# Altium schematic sheet Motor_Driver_THT.SchDoc
size A4
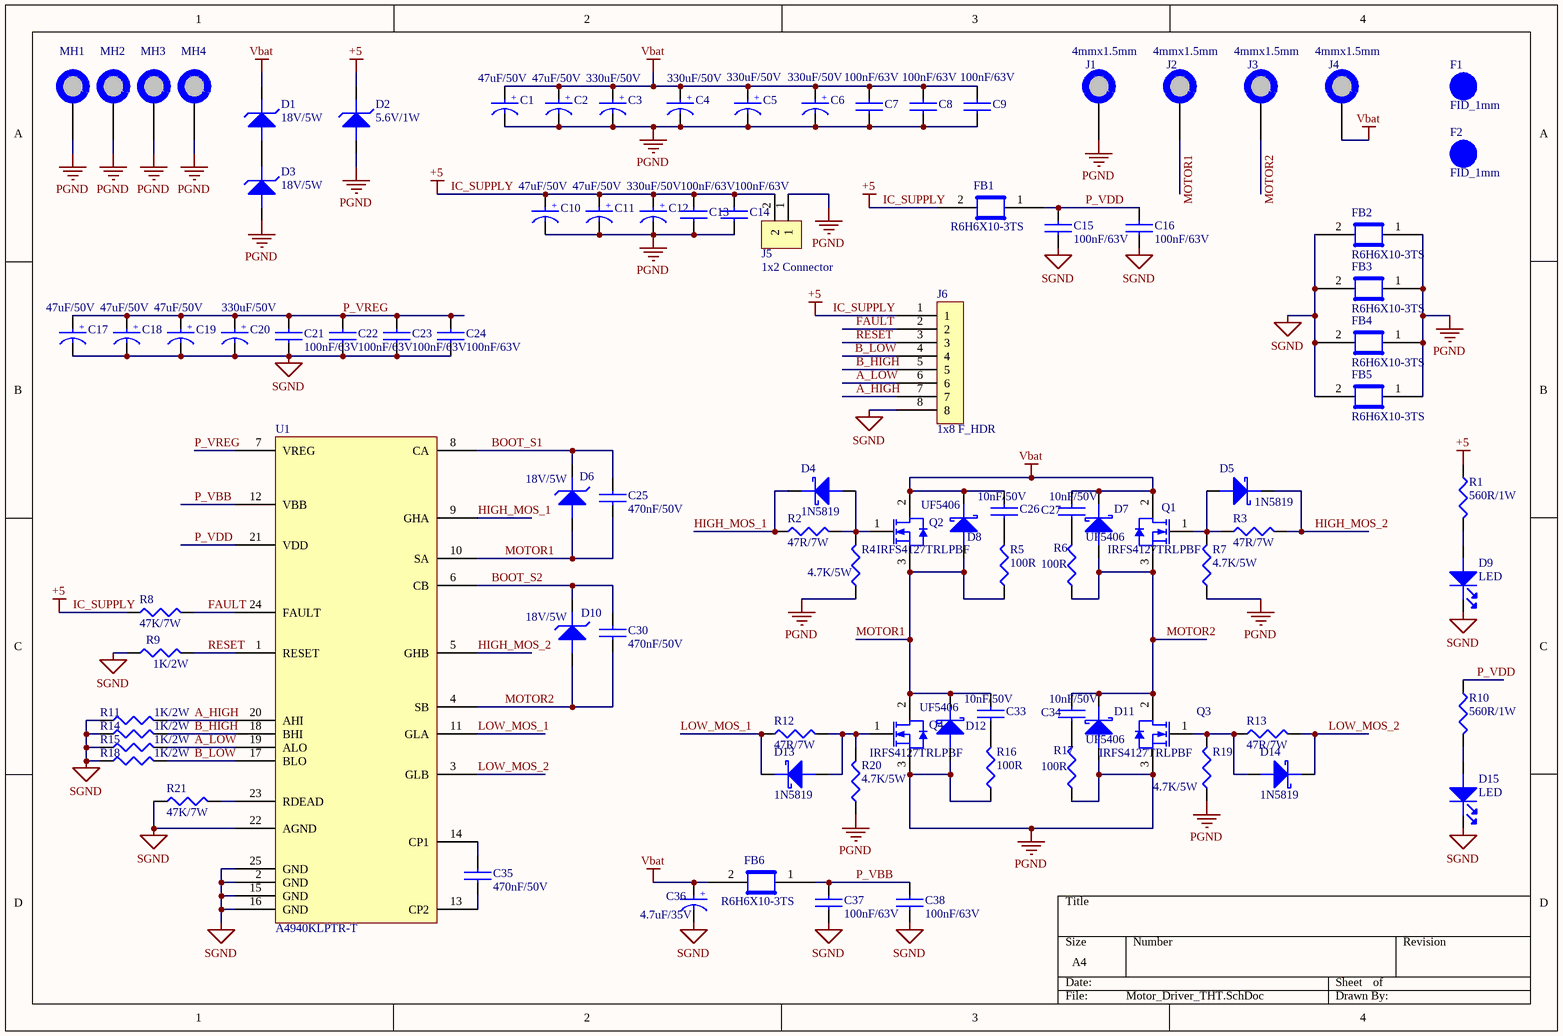
[diagram p0: Motor_Driver_THT.SchDoc]

## Parts
C1  47uF/50V  [6.3x11x2.5Capacitor]
C2  47uF/50V  [6.3x11x2.5Capacitor]
C3  330uF/50V  [THT-CAP/10x16]
C4  330uF/50V  [THT-CAP/10x16]
C5  330uF/50V  [THT-CAP/10x16]
C6  330uF/50V  [THT-CAP/10x16]
C7  100nF/63V  [Film Cap]
C8  100nF/63V  [Film Cap]
C9  100nF/63V  [Film Cap]
C10  47uF/50V  [6.3x11x2.5Capacitor]
C11  47uF/50V  [6.3x11x2.5Capacitor]
C12  330uF/50V  [THT-CAP/10x16]
C13  100nF/63V  [Film Cap]
C14  100nF/63V  [Film Cap]
C15  100nF/63V  [CERAMIC CAP]
C16  100nF/63V  [CERAMIC CAP]
C17  47uF/50V  [6.3x11x2.5Capacitor]
C18  47uF/50V  [6.3x11x2.5Capacitor]
C19  47uF/50V  [6.3x11x2.5Capacitor]
C20  330uF/50V  [THT-CAP/10x16]
C21  100nF/63V  [CERAMIC CAP]
C22  100nF/63V  [CERAMIC CAP]
C23  100nF/63V  [CERAMIC CAP]
C24  100nF/63V  [CERAMIC CAP]
C25  470nF/50V  [Film Cap]
C26  10nF/50V  [CERAMIC CAP]
C27  10nF/50V  [CERAMIC CAP]
C30  470nF/50V  [Film Cap]
C33  10nF/50V  [CERAMIC CAP]
C34  10nF/50V  [CERAMIC CAP]
C35  470nF/50V  [Film Cap]
C36  4.7uF/35V  [TANTALUM CAP THT 1]
C37  100nF/63V  [CERAMIC CAP]
C38  100nF/63V  [CERAMIC CAP]
D1  18V/5W  [1N4745]
D2  5.6V/1W  [1N4745]
D3  18V/5W  [1N4745]
D4  1N5819  [1N5819]
D5  1N5819  [1N5819]
D6  18V/5W  [1N4745]
D7  UF5406  [UF5406]
D8  UF5406  [UF5406]
D9  LED  [5mm LED]
D10  18V/5W  [1N4745]
D11  UF5406  [UF5406]
D12  UF5406  [UF5406]
D13  1N5819  [1N5819]
D14  1N5819  [1N5819]
D15  LED  [5mm LED]
F1  FID_1mm  [FID_40x120D]
F2  FID_1mm  [FID_40x120D]
FB1  R6H6X10-3TS  [1N4745]
FB2  R6H6X10-3TS  [1N4745]
FB3  R6H6X10-3TS  [1N4745]
FB4  R6H6X10-3TS  [1N4745]
FB5  R6H6X10-3TS  [1N4745]
FB6  R6H6X10-3TS  [1N4745]
J1  4mmx1.5mm  [PAD_WITH_HOLE_4mmx1.5mm]  (no BOM)
J2  4mmx1.5mm  [PAD_WITH_HOLE_4mmx1.5mm]  (no BOM)
J3  4mmx1.5mm  [PAD_WITH_HOLE_4mmx1.5mm]  (no BOM)
J4  4mmx1.5mm  [PAD_WITH_HOLE_4mmx1.5mm]  (no BOM)
J5  1x2 Connector  [Klemens 1x2]
J6  1x8 F_HDR  [1x8 2.54 mm F_HDR]
MH1  MOUNTING HOLE_7.4MMC_3.2MMD  [MH_7.2MMC_3.2MMD]  (value not drawn)
MH2  MOUNTING HOLE_7.4MMC_3.2MMD  [MH_7.2MMC_3.2MMD]  (value not drawn)
MH3  MOUNTING HOLE_7.4MMC_3.2MMD  [MH_7.2MMC_3.2MMD]  (value not drawn)
MH4  MOUNTING HOLE_7.4MMC_3.2MMD  [MH_7.2MMC_3.2MMD]  (value not drawn)
Q1  IRFS4127TRLPBF  [TO-220]
Q2  IRFS4127TRLPBF  [TO-220]
Q3  IRFS4127TRLPBF  [TO-220]
Q4  IRFS4127TRLPBF  [TO-220]
R1  560R/1W  [THT Resistor]
R2  47R/7W  [THT Resistor]
R3  47R/7W  [THT Resistor]
R4  4.7K/5W  [THT Resistor]
R5  100R  [THT Resistor]
R6  100R  [THT Resistor]
R7  4.7K/5W  [THT Resistor]
R8  47K/7W  [THT Resistor]
R9  1K/2W  [THT Resistor]
R10  560R/1W  [THT Resistor]
R11  1K/2W  [THT Resistor]
R12  47R/7W  [THT Resistor]
R13  47R/7W  [THT Resistor]
R14  1K/2W  [THT Resistor]
R15  1K/2W  [THT Resistor]
R16  100R  [THT Resistor]
R17  100R  [THT Resistor]
R18  1K/2W  [THT Resistor]
R19  4.7K/5W  [THT Resistor]
R20  4.7K/5W  [THT Resistor]
R21  47K/7W  [THT Resistor]
U1  A4940KLPTR-T  [A4940-TSOP65P640X120_HS-25N]

## Nets
IC_SUPPLY: C10.1 C11.1 C12.1 C13.2 C14.2 D2.1(Cathode) FB1.2 J5.2 J6.1 R1.1 R8.1  [also labelled +5]
PGND: C1.2 C2.2 C3.2 C4.2 C5.2 C6.2 C7.2 C8.2 C9.2 C10.2 C11.2 C12.2 C13.1 C14.1 D2.2(Anode) D3.2(Anode) D11.2(Anode) D12.2(Anode) FB2.1 FB3.1 FB4.1 FB5.1 J1.1 J5.1 MH1.1 MH2.1 MH3.1 MH4.1 Q3.3(SOURCE) Q4.3(SOURCE) R4.1 R7.1 R16.1 R17.1 R19.1 R20.1
SGND: C15.1 C16.1 C17.2 C18.2 C19.2 C20.2 C21.1 C22.1 C23.1 C24.1 C36.2 C37.1 C38.1 D9.1(Cathode) D15.1(Cathode) FB2.2 FB3.2 FB4.2 FB5.2 J6.8 R9.1 R11.1 R14.1 R15.1 R18.1 R21.1 U1.2(GND) U1.15(GND) U1.16(GND) U1.22(AGND) U1.25(GND)
Vbat: C1.1 C2.1 C3.1 C4.1 C5.1 C6.1 C7.1 C8.1 C9.1 C26.2 C27.2 C36.1 D1.1(Cathode) D7.1(Cathode) D8.1(Cathode) FB6.2 J4.1 Q1.2(DRAIN) Q2.2(DRAIN)
A_HIGH: J6.7 R11.2 U1.20(AHI)
A_LOW: J6.6 R15.2 U1.19(ALO)
B_HIGH: J6.5 R14.2 U1.18(BHI)
B_LOW: J6.4 R18.2 U1.17(BLO)
BOOT_S1: C25.2 D6.1(Cathode) U1.8(CA)
BOOT_S2: C30.2 D10.1(Cathode) U1.6(CB)
FAULT: J6.2 R8.2 U1.24(FAULT)
HIGH_MOS_1: D4.1(Cathode) R2.1 U1.9(GHA)
HIGH_MOS_2: D5.1(Cathode) R3.2 U1.5(GHB)
LOW_MOS_1: D13.1(Cathode) R12.1 U1.11(GLA)
LOW_MOS_2: D14.1(Cathode) R13.2 U1.3(GLB)
MOTOR1: C25.1 C33.2 D6.2(Anode) D8.2(Anode) D12.1(Cathode) J2.1 Q2.3(SOURCE) Q4.2(DRAIN) R5.1 U1.10(SA)
MOTOR2: C30.1 C34.2 D7.2(Anode) D10.2(Anode) D11.1(Cathode) J3.1 Q1.3(SOURCE) Q3.2(DRAIN) R6.1 U1.4(SB)
P_VBB: C37.2 C38.2 FB6.1 U1.12(VBB)
P_VDD: C15.2 C16.2 FB1.1 R10.1 U1.21(VDD)
P_VREG: C17.1 C18.1 C19.1 C20.1 C21.2 C22.2 C23.2 C24.2 U1.7(VREG)
RESET: J6.3 R9.2 U1.1(RESET)
NetC26_1: C26.1 R5.2
NetC27_1: C27.1 R6.2
NetC33_1: C33.1 R16.2
NetC34_1: C34.1 R17.2
NetC35_1: C35.1 U1.13(CP2)
NetC35_2: C35.2 U1.14(CP1)
NetD1_2: D1.2(Anode) D3.1(Cathode)
NetD4_2: D4.2(Anode) Q2.1(GATE) R2.2 R4.2
NetD5_2: D5.2(Anode) Q1.1(GATE) R3.1 R7.2
NetD9_2: D9.2(Anode) R1.2
NetD13_2: D13.2(Anode) Q4.1(GATE) R12.2 R20.2
NetD14_2: D14.2(Anode) Q3.1(GATE) R13.1 R19.2
NetD15_2: D15.2(Anode) R10.2
NetR21_2: R21.2 U1.23(RDEAD)

## Notes on the sheet
- (in symbol EXR470M50B) +
- (in symbol TKT4R7M3502BR) +
- (in symbol TZP331M1HG25R-330uF Aluminium) +

## Library data of the parts
C1 C2 C10 C11 C17-C19 = EXR470M50B: CAP.EL.47uF 50V 6x11 2.5mm
C3-C6 C12 C20 = TZP331M1HG25R-330uF Aluminium
C7-C9 C13 C14 = C241J104J20A201: Cap Film 0.1uF 63V PET 5% Stacked Radial 5mm 105°C Ammo Pack; Manufacturer: Surge Components; Capacitance: 100nF; Supplier 1: Avnet; Manufacturer Part Number: C241J104J20A201; RoHS: Yes; Category: Film Capacitors; Stock 1: 10000; Mount: Through Hole; Case/Package: Radial; Dielectric Material: PET; Min Operating Temperature: -55°C; Max Operating Temperature: 105°C; Termination: Radial; Voltage Rating: 63V; Tolerance: 5%; Lead Pitch: 5mm; Lead Free: Lead Free; ComponentLink1URL: https://datasheet.ciiva.com/17457/c241j104j20a201-17457906.pdf?src-supplier=Future+Electronics; ComponentLink1Description: https://datasheet.ciiva.com/17457/c241j104j20a201-17457906.pdf?src-supplier=Future+Electronics; Supplier Part Number 1: C241J104J20A201
C15 C16 C21-C24 C37 C38 = DSTK2614
C25 C30 C35 = DSTK2594
C26 C27 C33 C34 = SF1H103MB215Y
C36 = TKT4R7M3502BR
D1 D3 D6 D10 = 1N5355BRLG: ON SEMICONDUCTOR   1N5355BRLG   DIODE, ZENER, 18V, 5W, 017AA-2; Material: Plastic; Forward Voltage: 1.2V; Tolerance: 5%; Max Reverse Leakage Current: 500nA; Impedance: 2.5R; Zener Current: 264mA; Test Current: 65mA; Element Configuration: Single; ESD Protection: Yes; Supplier 1: RSComponents; Manufacturer: ON Semiconductor; Manufacturer Part Number: 1N5355BRLG; RoHS: Yes; Category: Zener Diodes; Stock 1: 34000; Pricing 1: 4000=0,17300, 8000=0,16100, 4000=1,32800, 8000=1,23900 (EUR); Case/Package: Axial; Number of Pins: 2; Weight: 0.01lb; Contact Plating: Tin,Matte; Min Operating Temperature: -65°C; Max Operating Temperature: 200°C; Package Quantity: 1; Max Power Dissipation: 5W; Packaging: Tape and Reel; Power Dissipation: 5W; Zener Voltage: 18V; Voltage Tolerance: 5%; Working Voltage: 18V; Max Reverse Current: 500nA; Voltage Rating (DC): 18V; Power Rating: 5W; Length: 8.89mm; Width: 3.68mm; Height: 3.68mm; Radiation Hardening: No; REACH SVHC: No SVHC; Lead Free: Lead Free; Halogen Free: Halogen Free; ComponentLink1URL: https://datasheet.ciiva.com/15142/getdatasheetpartid-53953-15142149.pdf?src-supplier=Verical; ComponentLink1Description: https://datasheet.ciiva.com/15142/getdatasheetpartid-53953-15142149.pdf?src-supplier=Verical; ComponentLink2URL: https://datasheet.ciiva.com/27051/1305181-27051928.pdf?src-supplier=Jameco; ComponentLink2Description: https://datasheet.ciiva.com/27051/1305181-27051928.pdf?src-supplier=Jameco; ComponentLink3URL: https://datasheet.ciiva.com/49028/70339225-49028950.pdf?src-supplier=Allied+Electronics; ComponentLink3Description: https://datasheet.ciiva.com/49028/70339225-49028950.pdf?src-supplier=Allied+Electronics; ComponentLink4URL: https://datasheet.ciiva.com/895/1n5333b-d-895371.pdf?src-supplier=Digi-Key; ComponentLink4Description: https://datasheet.ciiva.com/895/1n5333b-d-895371.pdf?src-supplier=Digi-Key; ComponentLink5URL: https://datasheet.ciiva.com/895/1n5333b-d-895372.pdf?src-supplier=Digi-Key; ComponentLink5Description: https://datasheet.ciiva.com/895/1n5333b-d-895372.pdf?src-supplier=Digi-Key; ComponentLink6URL: https://datasheet.ciiva.com/10639/1n5333b-d-10639005.pdf?src-supplier=Avnet; ComponentLink6Description: https://datasheet.ciiva.com/10639/1n5333b-d-10639005.pdf?src-supplier=Avnet; ComponentLink7URL: https://datasheet.ciiva.com/25927/1n5333b-d-25927373.pdf?src-supplier=Avnet+Europe; ComponentLink7Description: https://datasheet.ciiva.com/25927/1n5333b-d-25927373.pdf?src-supplier=Avnet+Europe; ComponentLink8URL: https://datasheet.ciiva.com/22626/1796584-22626831.pdf?src-supplier=Element14; ComponentLink8Description: https://datasheet.ciiva.com/22626/1796584-22626831.pdf?src-supplier=Element14; Supplier Part Number 1: 1868755
D2 = 1N4734A-HT
D4 D5 D13 D14 = 1N5819_AY_10001: Manufacturer: Pan Jit; Element Configuration: Single; Max Repetitive Reverse Voltage (Vrrm): 40V; Peak Non-Repetitive Surge Current: 25A; Forward Current: 1A; Max Reverse Current: 200uA; Supplier 1: Mouser; Manufacturer Part Number: 1N5819_AY_10001; RoHS: Yes; Category: Rectifier Diodes; Stock 1: 4975; Pricing 1: 1=0,41000, 10=0,22500, 100=0,10900, 500=0,08600, 1000=0,06000, 2500=0,05000 (USD); Mount: Through Hole; Number of Pins: 2; Min Operating Temperature: -55°C; Max Operating Temperature: 150°C; Radiation Hardening: No; ComponentLink1URL: https://datasheet.ciiva.com/8300/1n5817-series-8300210.pdf?src-supplier=Avnet; ComponentLink1Description: https://datasheet.ciiva.com/8300/1n5817-series-8300210.pdf?src-supplier=Avnet; Supplier Part Number 1: 241-1N5819_AY_10001
D9 D15 = LTL2R3SYK: LED AMBER CLEAR 5MM ROUND T/H; Manufacturer: Vishay Lite-On; Lens Color: Colorless; Color: Orange; Test Current: 20mA; Dominant Wavelength: 590nm; Lens Style: Dome; Luminous Intensity: 2800mcd; Viewing Angle: 30°; Wavelength: 594nm; Forward Voltage: 2.35V; Supplier 1: Mouser; Manufacturer Part Number: LTL2R3SYK; RoHS: Yes; Category: LEDs; Mount: Through Hole; Case/Package: Radial; Min Operating Temperature: -40°C; Max Operating Temperature: 80°C; Lens Transparency: Clear; Packaging: Bulk; Package Quantity: 1000; Illumination Color: Orange; Diameter: 5mm; Height: 8.7mm; ComponentLink1URL: http://www.mouser.com/ds/2/239/_100_LTL2P3SEK+SYK+2R3SEK+SYK-62951.pdf?src-supplier=Mouser; ComponentLink1Description: http://www.mouser.com/ds/2/239/_100_LTL2P3SEK+SYK+2R3SEK+SYK-62951.pdf?src-supplier=Mouser; ComponentLink2URL: https://media.digikey.com/pdf/Data%20Sheets/Lite-On%20PDFs/LTL2x3SEK,SYK.pdf?src-supplier=Digi-Key; ComponentLink2Description: https://media.digikey.com/pdf/Data%20Sheets/Lite-On%20PDFs/LTL2x3SEK,SYK.pdf?src-supplier=Digi-Key; Supplier Part Number 1: 859-LTL2R3SYK
F1 F2 = FID_1mm: Fiducial 40mil Diameter, 120mil mask
J1-J4 = PAD_WITH_HOLE_4mmx1.5mm
J5 = Klemens 2 Pin
J6 = 1X8 F_HDR 2.54mm
MH1-MH4 = MOUNTING HOLE_7.4MMC_3.2MMD: Mounting Hole  7.4mm, 3.2mm
Q1-Q4 = IRFS4127TRLPBF: MOSFET N-CH 200V 72A D2PAK; Manufacturer: International Rectifier; Rise Time: 18ns; Fall Time: 22ns; Turn-Off Delay Time: 56ns; Turn-On Delay Time: 17ns; Gate to Source Voltage (Vgs): 20V; Rds On Max: 22mR; Input Capacitance: 5.38nF; Max Power Dissipation: 375W; Element Configuration: Single; Supplier 1: Arrow; Manufacturer Part Number: IRFS4127TRLPBF; RoHS: Yes; Category: MOSFETs; Stock 1: 25; Pricing 1: 1=2,62080, 10=2,29670, 25=2,28010, 50=2,25740, 100=1,79330, 250=1,70640, 500=1,68930, 1000=1,44110, 3000=1,29240, 6000=1,28060, 15000=1,26780, 30000=1,25510, 75000=1,24260 (USD); Mount: Surface Mount; Case/Package: D2PAK; Number of Pins: 3; Min Operating Temperature: -55°C; Max Operating Temperature: 175°C; Continuous Drain Current (ID): 72A; Package Quantity: 1; Packaging: Tape and Reel; Drain to Source Voltage (Vdss): 200V; Drain to Source Breakdown Voltage: 200V; Drain to Source Resistance: 22mR; Power Dissipation: 375W; On-State Resistance: 22MR; ComponentLink1URL: https://datasheet.ciiva.com/939/irfs4127pbf-939456.pdf?src-supplier=Digi-Key; ComponentLink1Description: https://datasheet.ciiva.com/939/irfs4127pbf-939456.pdf?src-supplier=Digi-Key; ComponentLink2URL: https://datasheet.ciiva.com/939/irfs4127pbf-939457.pdf?src-supplier=Digi-Key; ComponentLink2Description: https://datasheet.ciiva.com/939/irfs4127pbf-939457.pdf?src-supplier=Digi-Key; ComponentLink3URL: https://datasheet.ciiva.com/939/irfs4127pbf-939458.pdf?src-supplier=Digi-Key; ComponentLink3Description: https://datasheet.ciiva.com/939/irfs4127pbf-939458.pdf?src-supplier=Digi-Key; ComponentLink4URL: https://datasheet.ciiva.com/16221/irfs4127pbf-16221031.pdf?src-supplier=Future+Electronics; ComponentLink4Description: https://datasheet.ciiva.com/16221/irfs4127pbf-16221031.pdf?src-supplier=Future+Electronics; Supplier Part Number 1: IRFS4127TRLPBF
R1 R10 = KNP01SJ0561A10
R2 R3 R12 R13 = RSS700470JB60
R4 R7 R19 R20 = MOR05UJ0472AA9
R5 R6 R16 R17 = KNP09SJ0101B00
R8 R21 = MOR07SJ0473B00: Manufacturer: Royal Ohm; Supplier 1: Avnet; Manufacturer Part Number: MOR07SJ0473B00; Supplier Part Number 1: YDL66R-24-61S46106
R9 R11 R14 R15 R18 = CFRF2SJ0102A19
U1 = A4940KLPTR-T: IC MOSF DVR FULL BRIDGE 24TSSOP; Manufacturer: Allegro MicroSystems; Number of Outputs: 4; Max Supply Voltage: 50V; Min Supply Voltage: 5.5V; Propagation Delay: 150ns; Number of Drivers: 1; Turn-Off Delay Time: 20ns; Turn-On Delay Time: 35ns; Supplier 1: Arrow; Manufacturer Part Number: A4940KLPTR-T; RoHS: Yes; Category: Gate Drivers; Stock 1: 11389; Pricing 1: 1=3,11000, 10=2,80000, 25=2,63700, 100=2,29400, 250=2,16500, 500=1,93900, 1000=1,63700, 3000=1,62100, 6000=1,58400, 4000=1,57300 (USD); Mount: Surface Mount; Case/Package: TSSOP; Number of Pins: 24; Min Operating Temperature: -40°C; Max Operating Temperature: 150°C; Package Quantity: 4000; Packaging: Tape and Reel; Radiation Hardening: No; ComponentLink1URL: https://datasheet.ciiva.com/1949/a4940-datasheet-1949840.pdf?src-supplier=Digi-Key; ComponentLink1Description: https://datasheet.ciiva.com/1949/a4940-datasheet-1949840.pdf?src-supplier=Digi-Key; ComponentLink2URL: https://datasheet.ciiva.com/1949/a4940-datasheet-1949840.pdf?src-supplier=Avnet; ComponentLink2Description: https://datasheet.ciiva.com/1949/a4940-datasheet-1949840.pdf?src-supplier=Avnet; ComponentLink3URL: https://datasheet.ciiva.com/26927/getdatasheetpartid-663856-26927910.pdf?src-supplier=Verical; ComponentLink3Description: https://datasheet.ciiva.com/26927/getdatasheetpartid-663856-26927910.pdf?src-supplier=Verical; ComponentLink4URL: https://datasheet.ciiva.com/17235/a4940-datasheet-17235002.pdf?src-supplier=Avnet+Europe; ComponentLink4Description: https://datasheet.ciiva.com/17235/a4940-datasheet-17235002.pdf?src-supplier=Avnet+Europe; Supplier Part Number 1: A4940KLPTR-T